# EAGLE schematic tick-display-mk-6 (EAGLE 6.5.0)
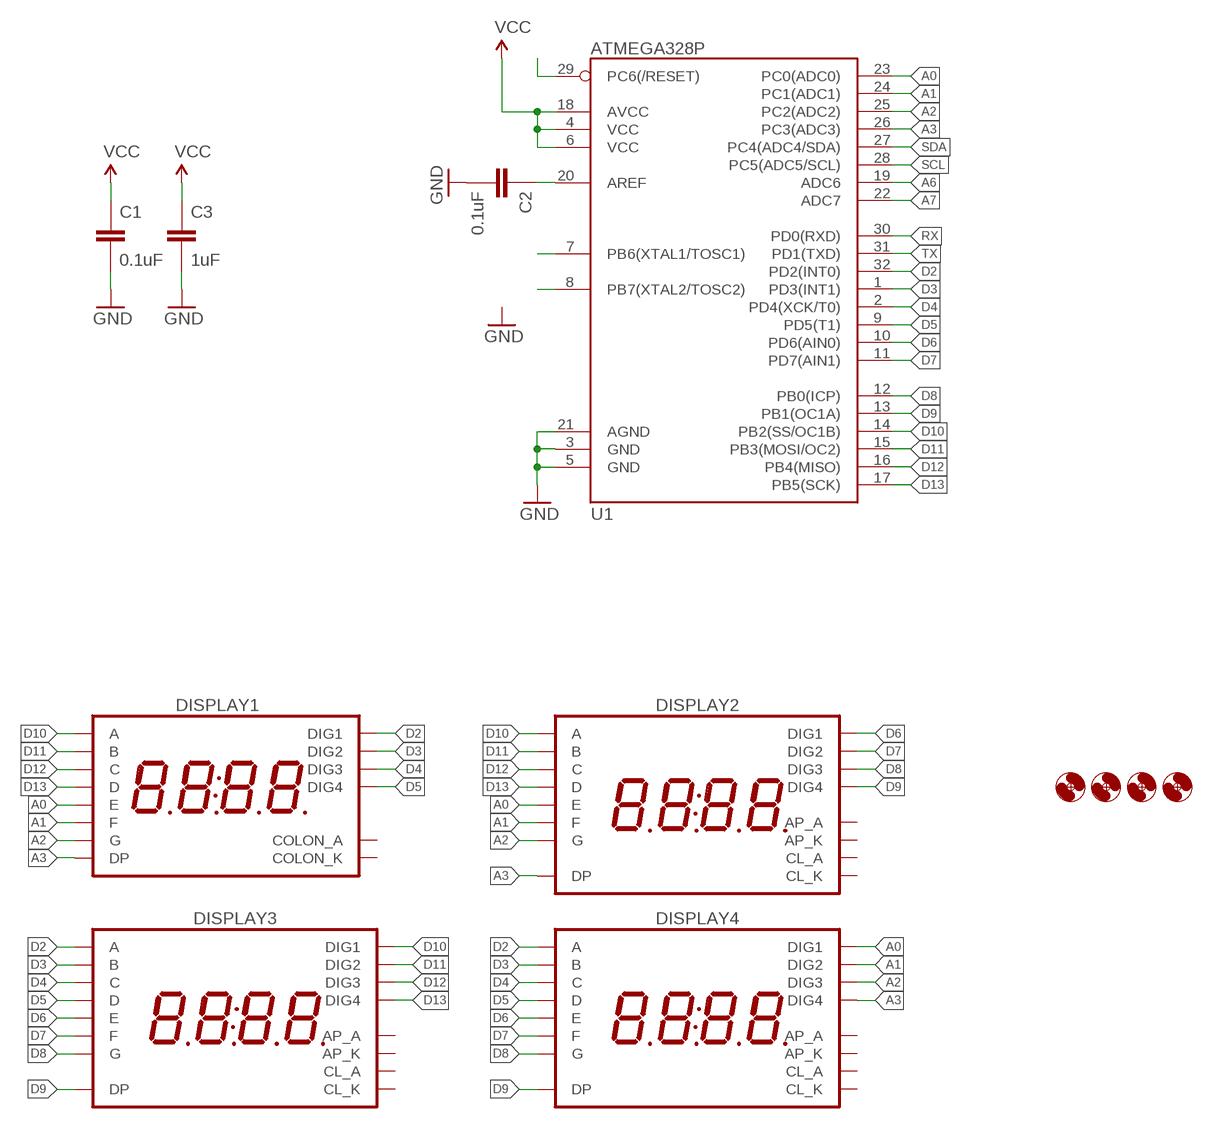
[diagram p0: schematic, sheet 1]

## Parts
C1  0.1uF  CAPACITOR-CERAMICC0603  [C0603]
C2  0.1uF  CAPACITOR-CERAMICC0603  [C0603]
C3  1uF  CAPACITOR-CERAMICC0805  [C0805]
DISPLAY1  7SEG_4DIGIT_COLON14.2MM-CC  [7SEG_4DIG_0.56IN_14MM_ADAFRUIT]
DISPLAY2  7SEG_4DIGIT_COLON_APOS  [7SEG_4DIG_10MM]
DISPLAY3  7SEG_4DIGIT_COLON_APOS  [7SEG_4DIG_10MM]
DISPLAY4  7SEG_4DIGIT_COLON_APOS  [7SEG_4DIG_10MM]
H1  HOLE#2  [HOLE-#2]
H2  HOLE#2  [HOLE-#2]
H3  HOLE#2  [HOLE-#2]
H4  HOLE#2  [HOLE-#2]
U1  ATMEGA328P  ATMEGA328_SMT  [TQFP32-08]

## Nets
A0: DISPLAY1.P$1(E) DISPLAY2.5(E) DISPLAY4.1(DIG1) U1.23(PC0(ADC0))
A1: DISPLAY1.P$12(F) DISPLAY2.11(F) DISPLAY4.2(DIG2) U1.24(PC1(ADC1))
A2: DISPLAY1.P$5(G) DISPLAY2.15(G) DISPLAY4.6(DIG3) U1.25(PC2(ADC2))
A3: DISPLAY1.P$3(DP) DISPLAY2.7(DP) DISPLAY4.8(DIG4) U1.26(PC3(ADC3))
A6: U1.19(ADC6)
A7: U1.22(ADC7)
D2: DISPLAY1.P$14(DIG1) DISPLAY3.14(A) DISPLAY4.14(A) U1.32(PD2(INT0))
D3: DISPLAY1.P$11(DIG2) DISPLAY3.16(B) DISPLAY4.16(B) U1.1(PD3(INT1))
D4: DISPLAY1.P$10(DIG3) DISPLAY3.13(C) DISPLAY4.13(C) U1.2(PD4(XCK/T0))
D5: DISPLAY1.P$6(DIG4) DISPLAY3.3(D) DISPLAY4.3(D) U1.9(PD5(T1))
D6: DISPLAY2.1(DIG1) DISPLAY3.5(E) DISPLAY4.5(E) U1.10(PD6(AIN0))
D7: DISPLAY2.2(DIG2) DISPLAY3.11(F) DISPLAY4.11(F) U1.11(PD7(AIN1))
D8: DISPLAY2.6(DIG3) DISPLAY3.15(G) DISPLAY4.15(G) U1.12(PB0(ICP))
D9: DISPLAY2.8(DIG4) DISPLAY3.7(DP) DISPLAY4.7(DP) U1.13(PB1(OC1A))
D10: DISPLAY1.P$13(A) DISPLAY2.14(A) DISPLAY3.1(DIG1) U1.14(PB2(SS/OC1B))
D11: DISPLAY1.P$9(B) DISPLAY2.16(B) DISPLAY3.2(DIG2) U1.15(PB3(MOSI/OC2))
D12: DISPLAY1.P$4(C) DISPLAY2.13(C) DISPLAY3.6(DIG3) U1.16(PB4(MISO))
D13: DISPLAY1.P$2(D) DISPLAY2.3(D) DISPLAY3.8(DIG4) U1.17(PB5(SCK))
GND: C1.2 C2.2 C3.2 U1.3(GND) U1.5(GND) U1.21(AGND)
N$39: U1.8(PB7(XTAL2/TOSC2))
N$41: U1.7(PB6(XTAL1/TOSC1))
N$42: U1.29(PC6(/RESET))
N$44: C2.1 U1.20(AREF)
RX: U1.30(PD0(RXD))
SCL: U1.28(PC5(ADC5/SCL))
SDA: U1.27(PC4(ADC4/SDA))
TX: U1.31(PD1(TXD))
VCC: C1.1 C3.1 U1.4(VCC) U1.6(VCC) U1.18(AVCC)
Unconnected: DISPLAY1.P$7(COLON_K) DISPLAY1.P$8(COLON_A) DISPLAY2.4(CL_A) DISPLAY2.9(AP_K) DISPLAY2.10(AP_A) DISPLAY2.12(CL_K) DISPLAY3.4(CL_A) DISPLAY3.9(AP_K) DISPLAY3.10(AP_A) DISPLAY3.12(CL_K) DISPLAY4.4(CL_A) DISPLAY4.9(AP_K) DISPLAY4.10(AP_A) DISPLAY4.12(CL_K)

## Library data of the parts
C1-C3 = A_butts:CAPACITOR-CERAMIC: CAPACITOR, European symbol
DISPLAY1 = A_butts:7SEG_4DIGIT_COLON
DISPLAY2-DISPLAY4 = A_butts:7SEG_4DIGIT_COLON_APOS
H1-H4 = A_butts:HOLE: MOUNTING HOLE with drill center marker
U1 = A_butts:ATMEGA328_SMT: 32-Pin Atmega328 part Commonly used on Arduino compatible boards Available in QFP and QFN packages TQFP is IC-09069 QFN is non-stock; PROD_ID: IC-09069